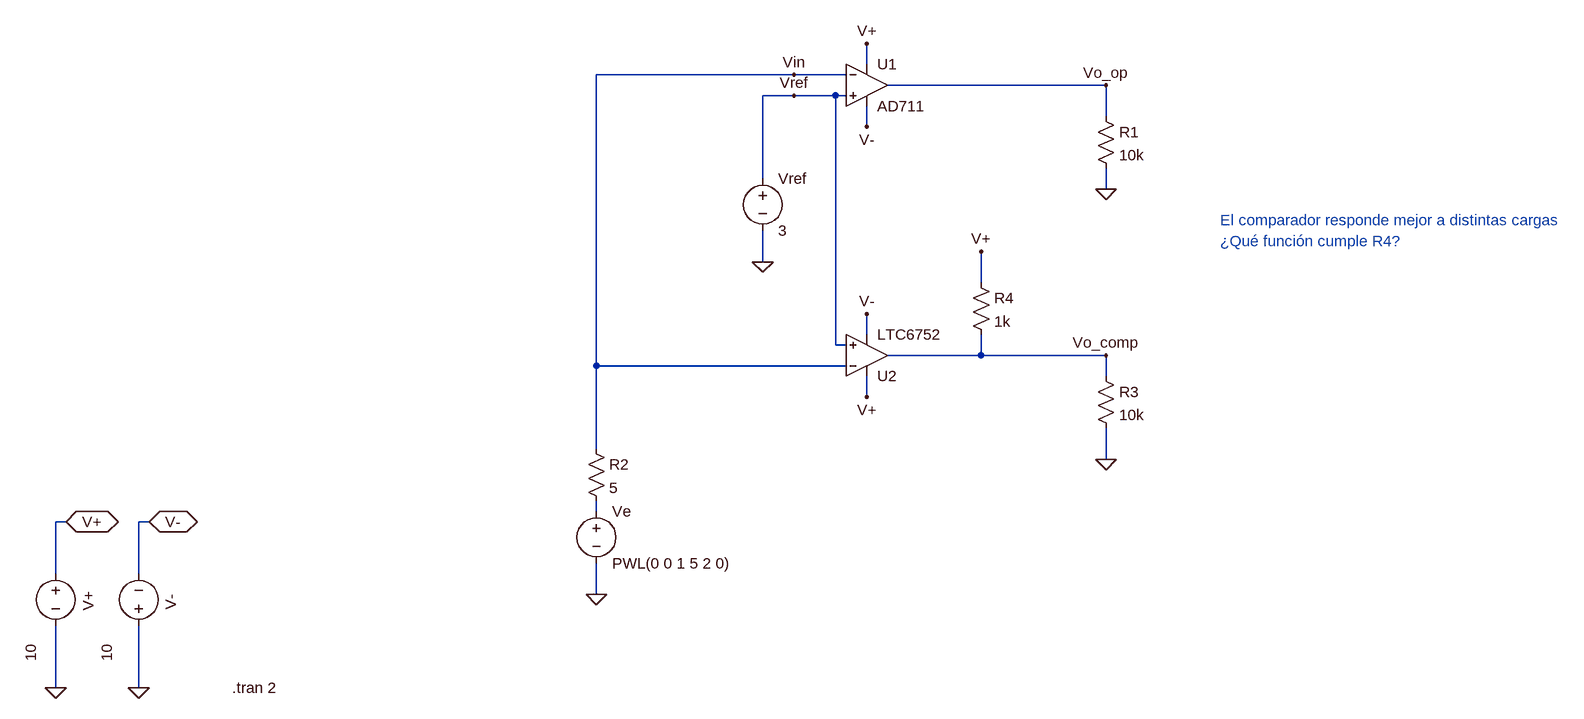
[diagram p0: schematic AO_Comp.asc]
AO_Comp.asc, the LTspice schematic file:
Version 4
SHEET 1 1432 1160
WIRE -176 -656 -176 -688
WIRE -288 -640 -592 -640
WIRE -208 -640 -288 -640
WIRE 192 -624 -144 -624
WIRE -288 -608 -336 -608
WIRE -224 -608 -288 -608
WIRE -208 -608 -224 -608
WIRE 192 -576 192 -624
WIRE -176 -560 -176 -592
WIRE -336 -480 -336 -608
WIRE 192 -464 192 -496
WIRE -336 -352 -336 -400
WIRE 0 -320 0 -368
WIRE -176 -240 -176 -272
WIRE -224 -224 -224 -608
WIRE -208 -224 -224 -224
WIRE 0 -208 0 -240
WIRE 0 -208 -144 -208
WIRE 192 -208 0 -208
WIRE -592 -192 -592 -640
WIRE -208 -192 -592 -192
WIRE 192 -176 192 -208
WIRE -176 -144 -176 -176
WIRE -592 -64 -592 -192
WIRE 192 -48 192 -96
WIRE -592 32 -592 16
WIRE -1408 48 -1424 48
WIRE -1280 48 -1296 48
WIRE -1424 128 -1424 48
WIRE -1296 128 -1296 48
WIRE -592 160 -592 112
WIRE -1424 304 -1424 208
WIRE -1296 304 -1296 208
FLAG -1424 304 0
FLAG -1296 304 0
FLAG -1408 48 V+
IOPIN -1408 48 BiDir
FLAG -1280 48 V-
IOPIN -1280 48 BiDir
FLAG -176 -688 V+
FLAG -176 -560 V-
FLAG -336 -352 0
FLAG 192 -464 0
FLAG -592 160 0
FLAG 192 -624 Vo_op
FLAG -288 -640 Vin
FLAG -288 -608 Vref
FLAG -176 -144 V+
FLAG -176 -272 V-
FLAG 192 -48 0
FLAG 0 -368 V+
FLAG 192 -208 Vo_comp
SYMBOL voltage -1424 112 R0
WINDOW 123 0 0 Left 0
WINDOW 39 0 0 Left 0
WINDOW 0 50 43 VRight 2
WINDOW 3 -38 124 VRight 2
SYMATTR InstName V+
SYMATTR Value 10
SYMBOL voltage -1296 224 R180
WINDOW 0 -49 40 VRight 2
WINDOW 3 49 -39 VRight 2
WINDOW 123 0 0 Left 0
WINDOW 39 0 0 Left 0
SYMATTR InstName V-
SYMATTR Value 10
SYMBOL OpAmps\\AD711 -176 -688 R0
SYMATTR InstName U1
SYMBOL voltage -336 -496 R0
WINDOW 123 0 0 Left 0
WINDOW 39 0 0 Left 0
SYMATTR InstName Vref
SYMATTR Value 3
SYMBOL res 176 -592 R0
SYMATTR InstName R1
SYMATTR Value 10k
SYMBOL voltage -592 16 R0
WINDOW 123 0 0 Left 0
WINDOW 39 0 0 Left 0
SYMATTR InstName Ve
SYMATTR Value PWL(0 0 1 5 2 0)
SYMBOL res -608 -80 R0
SYMATTR InstName R2
SYMATTR Value 5
SYMBOL Comparators\\LTC6752 -176 -144 M180
SYMATTR InstName U2
SYMBOL res 176 -192 R0
SYMATTR InstName R3
SYMATTR Value 10k
SYMBOL res -16 -336 R0
SYMATTR InstName R4
SYMATTR Value 1k
TEXT -1152 304 Left 2 !.tran 2
TEXT 368 -416 Left 2 ;El comparador responde mejor a distintas cargas
TEXT 368 -384 Left 2 ;¿Qué función cumple R4?

The netlist it stands for:
* AO_Comp.asc
V+ V+ 0 10
V- 0 V- 10
XU1 Vref Vin V+ V- Vo_op AD712  ; AD711, pins In+ In- V+ V- OUT
Vref Vref 0 3
R1 Vo_op 0 10k
Ve N001 0 PWL(0 0 1 5 2 0)
R2 Vin N001 5
XU2 Vref Vin V+ V- Vo_comp LTC6752  ; pins In+ In- V+ V- OUT
R3 Vo_comp 0 10k
R4 V+ Vo_comp 1k
.tran 2
* El comparador responde mejor a distintas cargas
* ¿Qué función cumple R4?
.lib ADI1.lib
.lib LTC7.lib
.backanno
.end